# EAGLE design mainboard (EAGLE 9.6.2)
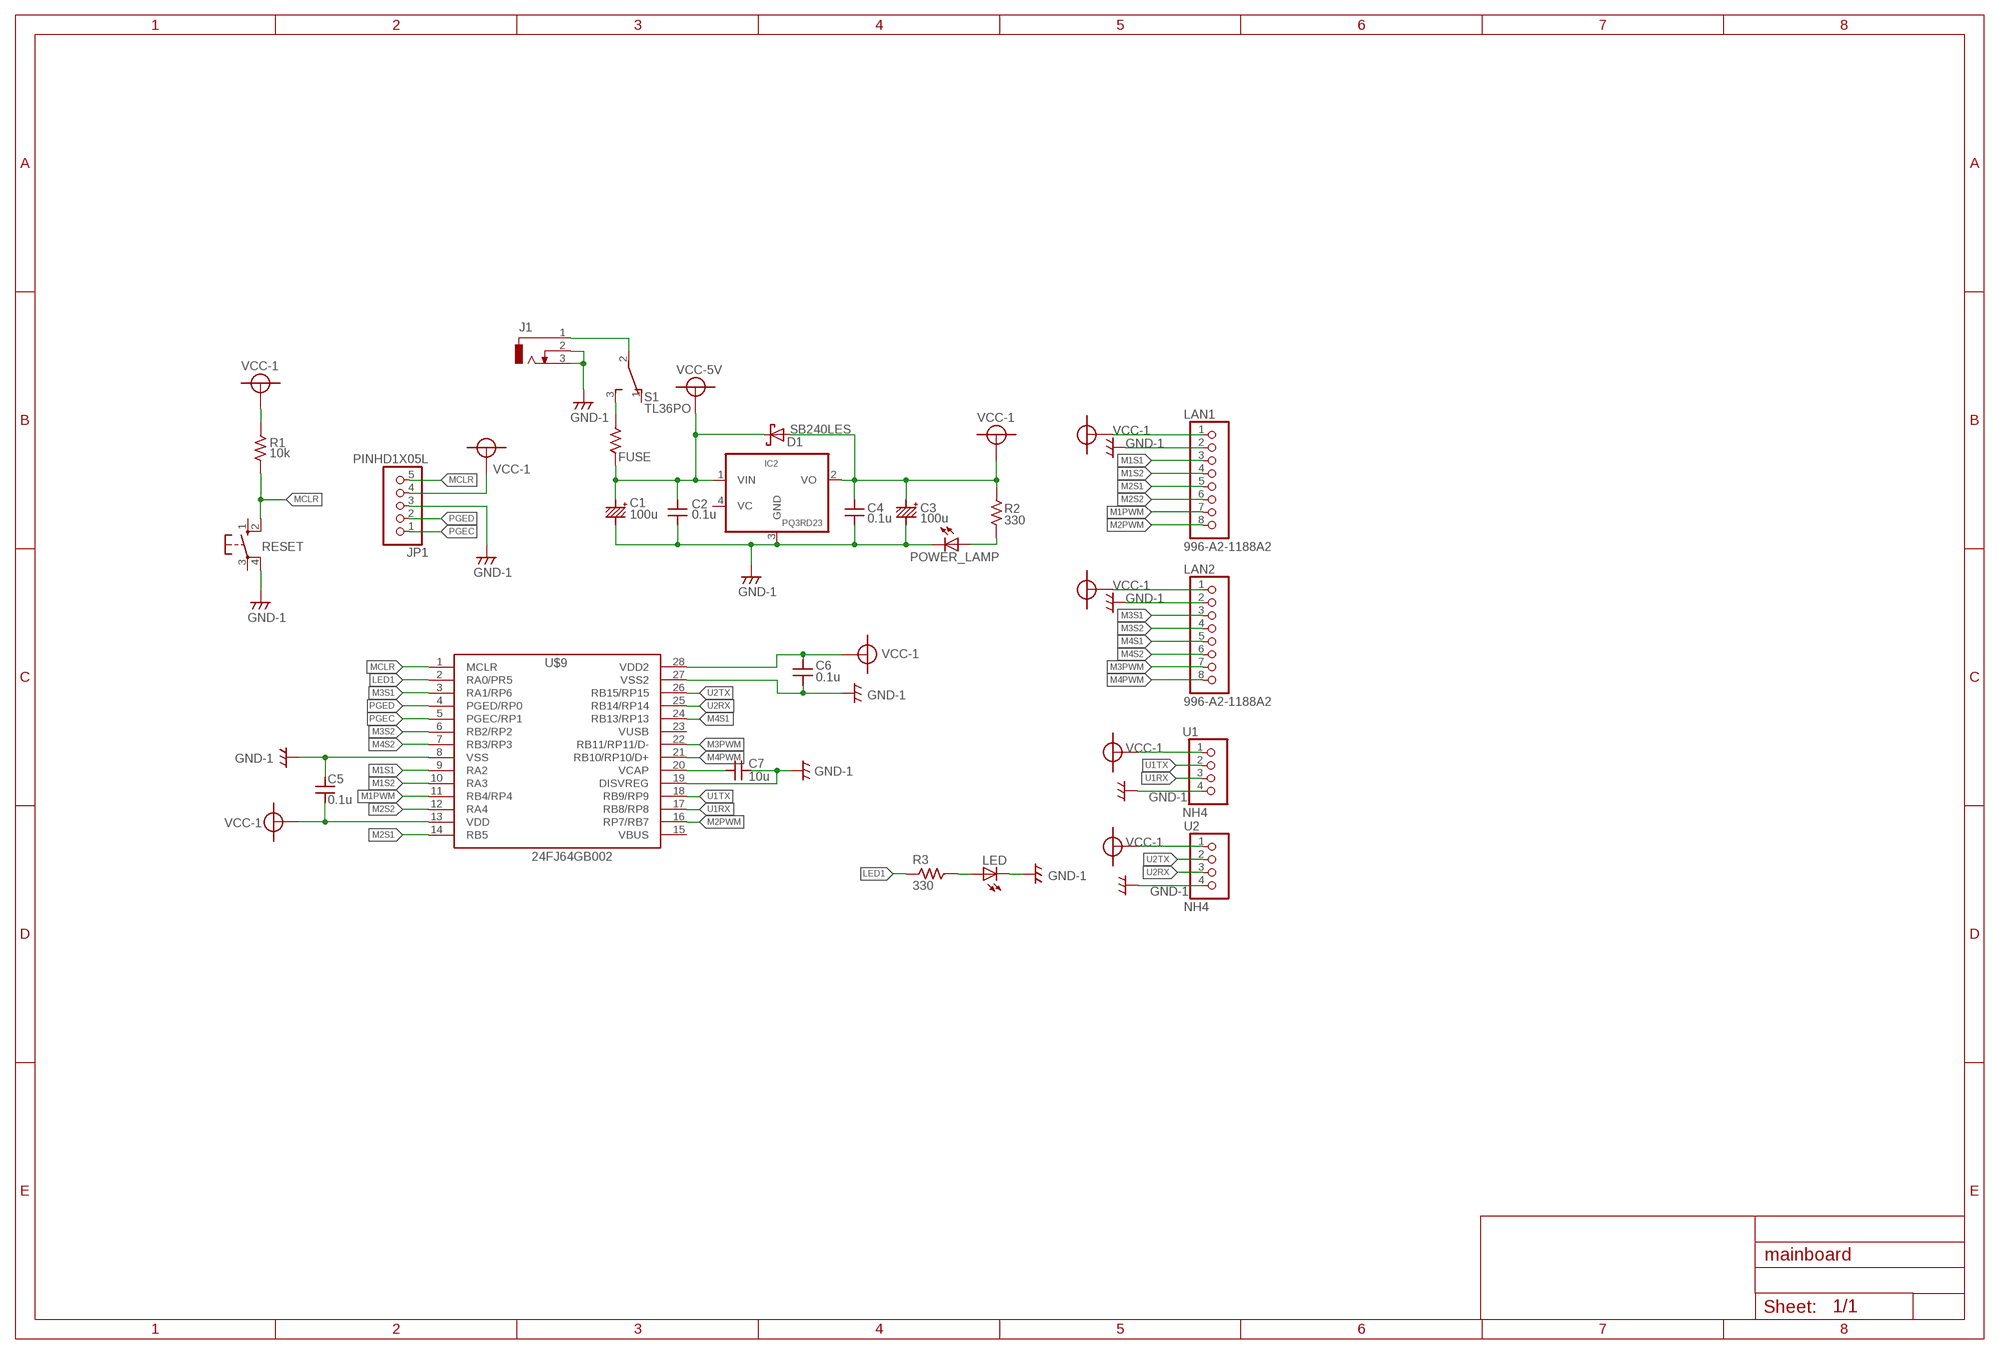
[diagram p0: schematic, sheet 1]

## Parts
C1  100u  C+25V100  [CC:3]
C2  0.1u  CC2.54  [C:1]
C3  100u  C+25V100  [CC:3]
C4  0.1u  CC2.54  [C:1]
C5  0.1u  CC2.54  [C:1]
C6  0.1u  CC2.54  [C:1]
C7  10u  CC2.54  [C:1]
D1  SB240LES  [DO35-7]
FUSE  R3216(1206)  [C3216]
IC2  PQ3RD23  [TO220BV-4]
J1  DCJ0303  [DCJ0303]
JP1  PINHD1X05L  [1X05L]
LAN1  996-A2-1188A2  [996-A2-1188A2]
LAN2  996-A2-1188A2  [996-A2-1188A2]
LED  LED""  [LED5MM]
POWER_LAMP  LED""  [LED5MM]
R1  10k  R1/4W  [R:1/4W]
R2  330  R1/4W  [R:1/4W]
R3  330  R1/4W  [R:1/4W]
RESET  10-XX  [B3F-10XX]
S1  TL36PO  [TL3XPO]
U1  NH4  [NH4]
U2  NH4  [NH4]
U$9  24FJ64GB002  [DIL28-3]

## Nets
+5V: C1.+(P$1+) C2.P$1 D1.C FUSE.1 IC2.1(VIN) ; supply symbol labelled VCC-5V
GND: C1.-(P$2-) C2.P$2 C3.-(P$2-) C4.P$2 C5.P$1 C6.P$2 C7.P$2 IC2.3(GND) J1.2 J1.3 JP1.3 LAN1.2 LAN2.2 LED.K(C) POWER_LAMP.K(C) RESET.4(P1) U1.4 U2.4 U$9.8(VSS) U$9.19(DISVREG) U$9.27(VSS2) ; supply symbol labelled GND-1
LED1: R3.P$1 U$9.2(RA0/PR5)
M1PWM: LAN1.7 U$9.11(RB4/RP4)
M1S1: LAN1.3 U$9.9(RA2)
M1S2: LAN1.4 U$9.10(RA3)
M2PWM: LAN1.8 U$9.16(RP7/RB7)
M2S1: LAN1.5 U$9.14(RB5)
M2S2: LAN1.6 U$9.12(RA4)
M3PWM: LAN2.7 U$9.22(RB11/RP11/D-)
M3S1: LAN2.3 U$9.3(RA1/RP6)
M3S2: LAN2.4 U$9.6(RB2/RP2)
M4PWM: LAN2.8 U$9.21(RB10/RP10/D+)
M4S1: LAN2.5 U$9.24(RB13/RP13)
M4S2: LAN2.6 U$9.7(RB3/RP3)
MCLR: JP1.5 R1.P$1 RESET.2(S1) U$9.1(MCLR)
N$1: LED.A R3.P$2
N$2: J1.1 S1.2(P)
N$3: POWER_LAMP.A R2.P$1
N$4: FUSE.2 S1.3(S)
N$15: C7.P$1 U$9.20(VCAP)
PGEC: JP1.1 U$9.5(PGEC/RP1)
PGED: JP1.2 U$9.4(PGED/RP0)
U1RX: U1.3 U$9.17(RB8/RP8)
U1TX: U1.2 U$9.18(RB9/RP9)
U2RX: U2.3 U$9.25(RB14/RP14)
U2TX: U2.2 U$9.26(RB15/RP15)
VCC-1: C3.+(P$1+) C4.P$1 C5.P$2 C6.P$1 D1.A IC2.2(VO) JP1.4 LAN1.1 LAN2.1 R1.P$2 R2.P$2 U1.1 U2.1 U$9.13(VDD) U$9.28(VDD2)
Unconnected: IC2.4(VC) RESET.1(S) RESET.3(P) S1.1(O) U$9.15(VBUS) U$9.23(VUSB)

## Library data of the parts
C1 C3 = Robocon-RLC:C+: Condensare
C2 C4-C7 = Robocon-RLC:CC: Ceramic Condensare
D1 = Robocon-Diode:SB240LES
FUSE R1-R3 = Robocon-RLC:R: Resistor
IC2 = Robocon-Regulator:PQ3RD23
J1 = con-jack:DCJ0303: DC POWER JACK Source: DCJ0303.pdf; OC_FARNELL: unknown; OC_NEWARK: unknown
JP1 = Robocon-Connector:PINHD1X05L
LAN1 LAN2 = Robocon-Connector:996-A2-1188A2: LAN_Connectoｒ 996-A2-1188A2 Made by PINREX
LED POWER_LAMP = Robocon-Diode:LED
RESET = Robocon-Switches:10-XX: OMRON SWITCH; MPN: B3F-1000; OC_FARNELL: 176432; OC_NEWARK: 36M3542
S1 = Robocon-Switches:TL36PO: TINY SWITCH ON - ON Source: http://www2.produktinfo.conrad.com/datenblaetter/700000-724999/705152-da-01-de-Subminiaturschalter_TL_36YO.pdf
U1 U2 = Robocon-Connector:NH4
U$9 = Robocon-PICMicroController:24FJ64GB002

## Net classes
0 default: clearance 0.21 mm

## Board
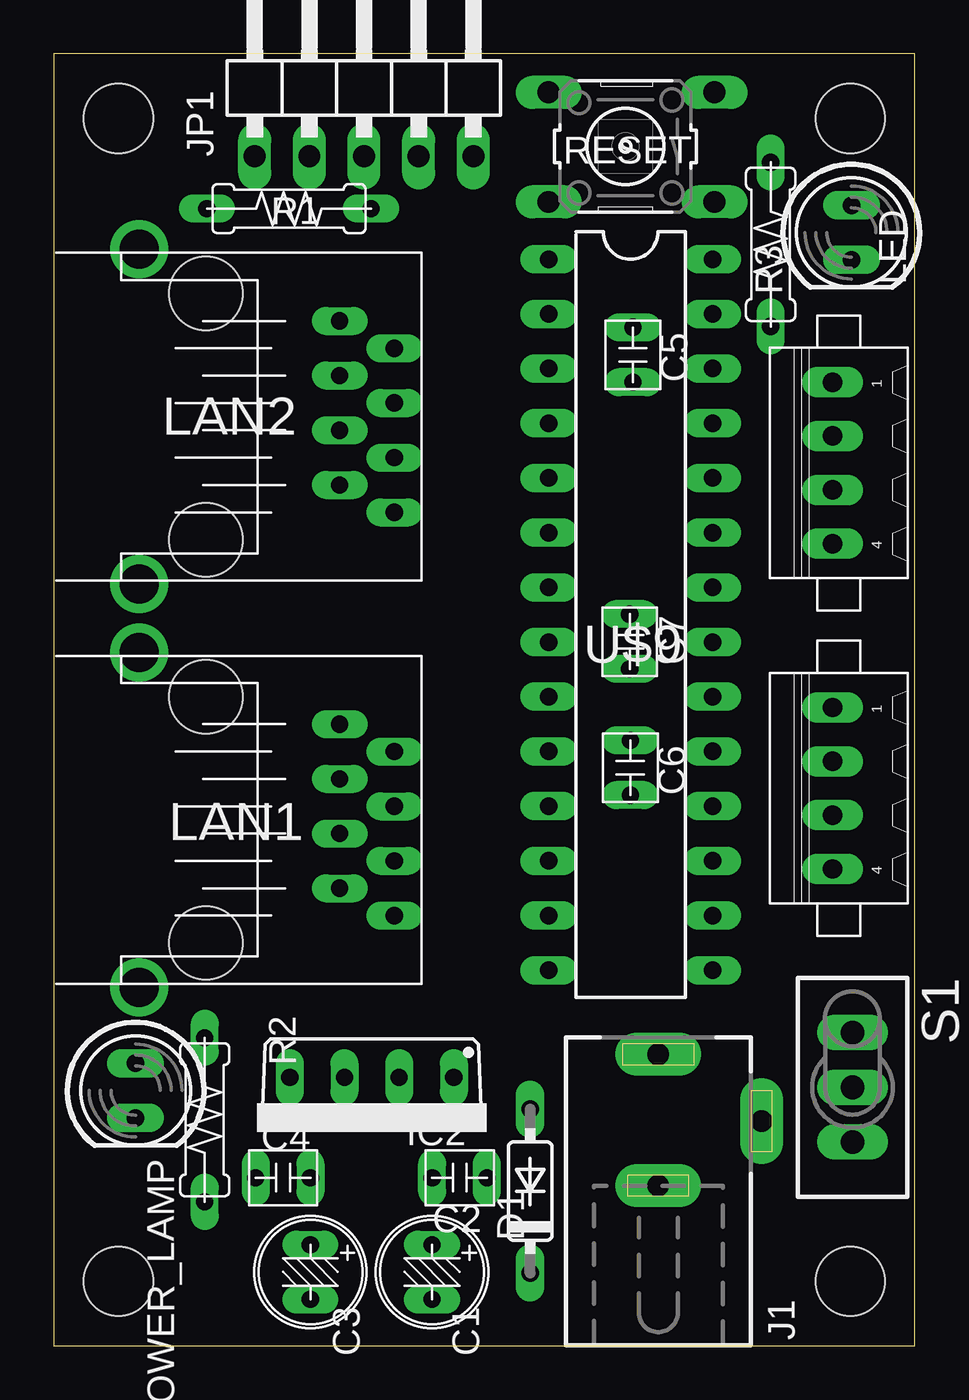
[diagram p1: board, top side]
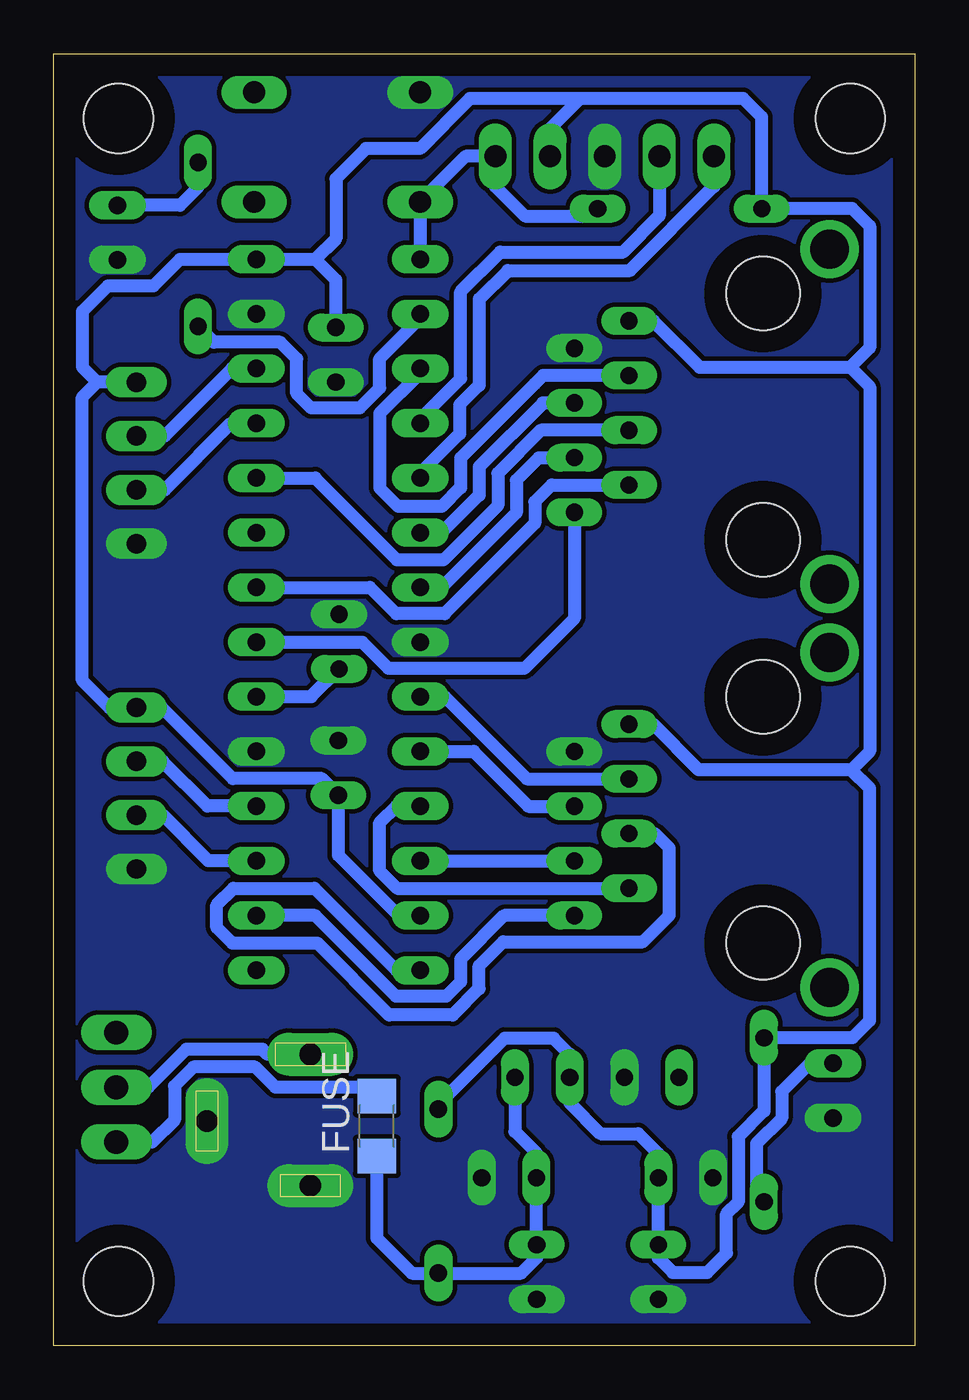
[diagram p2: board, bottom side, seen from below]

Size 40 x 60 mm. Coordinates in mm from the lower left corner, seen from the top.
Outline: 0,0 40,0 40,60 0,60 0,0
Copper layers (1*16): Top 0.035mm / dielectric 1.5mm / Bottom 0.035mm
Design rules "default": minimum track width 6mil, minimum drill 0.35mm, track to track 6mil, track to pad 6mil, pad to pad 6mil, via to via 6mil, smd to smd 6mil, copper to edge 40mil, drill to drill 6mil, minimum pad ring 10mil, minimum via ring 8mil, stop-mask expansion 4mil, vias tented up to drill 0mil, thermal gap 10mil
Holes 3.2 mm at 3,3 37,3 3,57 37,57

### Footprints (pad centres in the part's own frame; a part is rotated, then mirrored left to right if it is on the bottom)
CC:3 = drill 0.8 long: + -1.27,0; - 1.27,0
C:1 = drill 0.8 long: P$1 -1.27,0; P$2 1.27,0
DO35-7 = drill 0.813 long: A 3.81,0; C -3.81,0
C3216 = smd 1.6 x 1.8: 1 -1.4,0; 2 1.4,0
TO220BV-4 = drill 0.8 long: 1 -3.81,-2.54; 2 -1.27,-2.54; 3 1.27,-2.54; 4 3.81,-2.54
DCJ0303 = drill 1 pad 2 long: 1 0,3.1; 2 4.8,0; 3 0,-3
1X05L = drill 1.016 long: 1 -5.08,-3.81; 2 -2.54,-3.81; 3 0,-3.81; 4 2.54,-3.81; 5 5.08,-3.81
996-A2-1188A2 = drill 0.8 long: 1 -4.465,4.69; 2 -3.195,7.23; 3 -1.925,4.69; 4 -0.655,7.23; 5 0.615,4.69; 6 1.885,7.23; 7 3.155,4.69; 8 4.425,7.23 | drill 1.8: P$1 -7.795,-4.623; P$2 7.755,-4.623 | hole 3.4: -5.735,-1.533; 5.695,-1.533
LED5MM = drill 0.813 long: A -1.27,0; K 1.27,0
R:1/4W = drill 0.8 long: P$1 -3.81,0; P$2 3.81,0
B3F-10XX = drill 1.016 long: 1 -2.553,2.578; 2 5.156,2.578; 3 -2.553,-2.515; 4 5.156,-2.515
TL3XPO = drill 1.1 pad 1.422 long: 1 -2.54,0; 2 0,0; 3 2.54,0
NH4 = drill 0.9 long: 1 3.75,0.3; 2 1.25,0.3; 3 -1.25,0.3; 4 -3.75,0.3
DIL28-3 = drill 0.813 long: 1 -16.51,-3.81; 2 -13.97,-3.81; 3 -11.43,-3.81; 4 -8.89,-3.81; 5 -6.35,-3.81; 6 -3.81,-3.81; 7 -1.27,-3.81; 8 1.27,-3.81; 9 3.81,-3.81; 10 6.35,-3.81; 11 8.89,-3.81; 12 11.43,-3.81; 13 13.97,-3.81; 14 16.51,-3.81; 15 16.51,3.81; 16 13.97,3.81; 17 11.43,3.81; 18 8.89,3.81; 19 6.35,3.81; 20 3.81,3.81; 21 1.27,3.81; 22 -1.27,3.81; 23 -3.81,3.81; 24 -6.35,3.81; 25 -8.89,3.81; 26 -11.43,3.81; 27 -13.97,3.81; 28 -16.51,3.81

### Placement (x,y rotation side)
C1  17.57,3.42 270 top
C2  18.85,7.8 0 top
C3  11.92,3.42 270 top
C4  10.65,7.8 180 top
C5  26.9,46.02 90 top
C6  26.78,26.84 90 top
C7  26.75,32.7 90 top
D1  22.13,7.18 90 top
FUSE  25,10.2 90 bottom
IC2  14.77,9.92 180 top
J1  28.08,10.43 0 top
JP1  14.41,59.05 0 top
LAN1  8.59,24.4 270 top
LAN2  8.59,43.13 270 top
LED  37.05,51.7 270 top
POWER_LAMP  3.8,11.85 270 top
R1  10.93,52.81 180 top
R2  7.01,10.49 90 top
R3  33.3,51.15 90 top
RESET  28.14,55.7 180 top
S1  37.1,12 270 top
U1  36.47,25.89 90 top
U2  36.47,41 90 top
U$9  26.79,33.95 270 top

### Tracks (layer width: path | path; a pad name or v marks a point on that pad's centre or on a via)
+5V
  Bottom 0.61: IC2.1 18.58,9.95 17.58,8.95 C2.P$1 C1.+ 17.57,4.09 18.29,3.37 D1.C 23.37,3.37 25,5 FUSE.1
GND
  pour Bottom (isolate 0.21, no thermals): -1,61 -1,-1 41,-1 41,61
LED1
  Bottom 0.61: R3.P$1 32.56,46.6 29.48,46.6 28.72,45.84 28.72,44.23 28.04,43.55 25.79,43.55 24.86,44.48 24.86,45.84 22.98,47.72 U$9.2
M1PWM
  Bottom 0.61: U$9.11 24.09,25.06 24.86,24.29 24.86,22.06 24.05,21.25 LAN1.7
M1S1
  Bottom 0.61: U$9.9 21.84,30.14 18.02,26.32 LAN1.3
M1S2
  Bottom 0.61: U$9.10 20.5,27.6 17.95,25.05 LAN1.4
M2PWM
  Bottom 0.61: LAN1.8 19.08,19.98 21.1,17.95 21.1,16.9 21.78,16.22 24.1,16.22 27.86,19.98 U$9.16
M2S1
  Bottom 0.61: LAN1.5 12.09,23.79 11.41,23.11 11.41,19.98 12.64,18.76 19.13,18.76 20.24,17.65 20.24,16.58 21.46,15.36 24.42,15.36 27.76,18.7 31.71,18.7 32.44,19.43 32.44,20.47 31.66,21.25 27.9,21.25 24.09,17.44 U$9.14
M2S2
  Bottom 0.61: U$9.12 15.91,22.52 LAN1.6
M3PWM
  Bottom 0.61: U$9.22 25.32,35.22 24.1,34 21.85,34 17.65,38.2 17.65,39.2 16.88,39.98 LAN2.7
M3S1
  Bottom 0.61: U$9.3 22.98,45.18 24.86,43.3 24.86,39.84 24,38.98 21.97,38.98 21.1,39.85 21.1,41.23 17.66,44.66 17.27,45.05 LAN2.3
M3S2
  Bottom 0.61: LAN2.4 17.28,43.78 20.24,40.83 20.24,39.5 21.98,37.76 U$9.6
M4PWM
  Bottom 0.61: U$9.21 25.67,32.68 24.45,31.46 18.14,31.46 15.82,33.78 LAN2.8
M4S1
  Bottom 0.61: U$9.24 27.86,40.3 24.06,36.5 21.9,36.5 19.38,39.02 19.38,40.51 17.38,42.52 LAN2.5
M4S2
  Bottom 0.61: LAN2.6 17.47,41.24 18.52,40.2 18.52,38.68 21.98,35.22 U$9.7
MCLR
  Bottom 0.61: R1.P$1 15.09,52.46 18.11,52.46 19.49,53.84 JP1.5 20.87,55.24 RESET.2 U$9.1
N$1
  Bottom 0.61: R3.P$2 33.3,53.81 34.14,52.97 LED.A
N$2
  Bottom 0.61: J1.1 30.08,13.53 30.31,13.76 33.85,13.76 35.61,12 S1.2
N$3
  Bottom 0.61: POWER_LAMP.A 4.88,13.12 6.19,11.81 6.19,10.56 7.36,9.39 7.36,7.03 R2.P$1
N$4
  Bottom 0.61: FUSE.2 25.4,12 29.71,12 30.65,12.95 33.51,12.95 34.4,12.06 34.4,10.5 35.44,9.46 S1.3
N$15
  Bottom 0.61: U$9.20 28.04,30.14 C7.P$1
PGEC
  Bottom 0.61: JP1.1 9.33,53.84 13.24,49.94 18.91,49.94 20.24,48.61 20.24,44.61 21.14,43.71 21.14,42.35 22.98,40.52 U$9.5
PGED
  Bottom 0.61: JP1.2 11.87,52.48 13.55,50.8 19.25,50.8 21.1,48.95 21.1,44.92 22.98,43.04 U$9.4
U1RX
  Bottom 0.61: U$9.17 32.82,22.52 34.94,24.64 U1.3
U1TX
  Bottom 0.61: U$9.18 32.86,25.06 34.94,27.14 U1.2
U2RX
  Bottom 0.61: U$9.25 31.76,42.84 34.85,39.75 U2.3
U2TX
  Bottom 0.61: U$9.26 31.72,45.38 34.85,42.25 U2.2
VCC-1
  Bottom 0.61: U$9.13 23.98,19.98 26.78,22.78 C6.P$1 27.54,26.33 31.68,26.33 34.99,29.64 U1.1 37.42,29.64 38.68,30.9 38.68,44.05 37.98,44.75 | 3.01,45.44 9.99,45.44 12.14,47.59 LAN2.1 | 2.95,26.75 10.05,26.75 12.16,28.86 LAN1.1 | 15.55,57.92 7.97,57.92 7.12,57.06 R1.P$2 2.91,52.81 2.1,52 2.1,46.35 3.01,45.44 | 15.55,57.92 20.68,57.92 23,55.6 25.5,55.6 26.9,54.2 26.9,51.42 27.86,50.46 | JP1.4 16.95,56.52 15.55,57.92 | D1.A 22.13,11.22 19.06,14.28 16.78,14.28 16.04,13.54 IC2.2 16.04,11.29 14.6,9.85 12.85,9.85 11.92,8.92 C4.P$1 C3.+ 11.92,4.07 11.25,3.4 9.65,3.4 8.75,4.3 8.75,6.12 8.21,6.66 8.21,9.7 7.01,10.9 R2.P$2 2.9,14.3 2.1,15.1 2.1,25.9 2.95,26.75 | C5.P$2 26.9,49.5 27.86,50.46 | 3.01,45.44 2.1,44.54 2.1,27.6 2.95,26.75 | U2.1 37.98,44.75 | 37.98,44.75 38.68,45.45 38.68,48.03 37.48,49.23 35.37,49.23 34.14,50.46 U$9.28 27.86,50.46